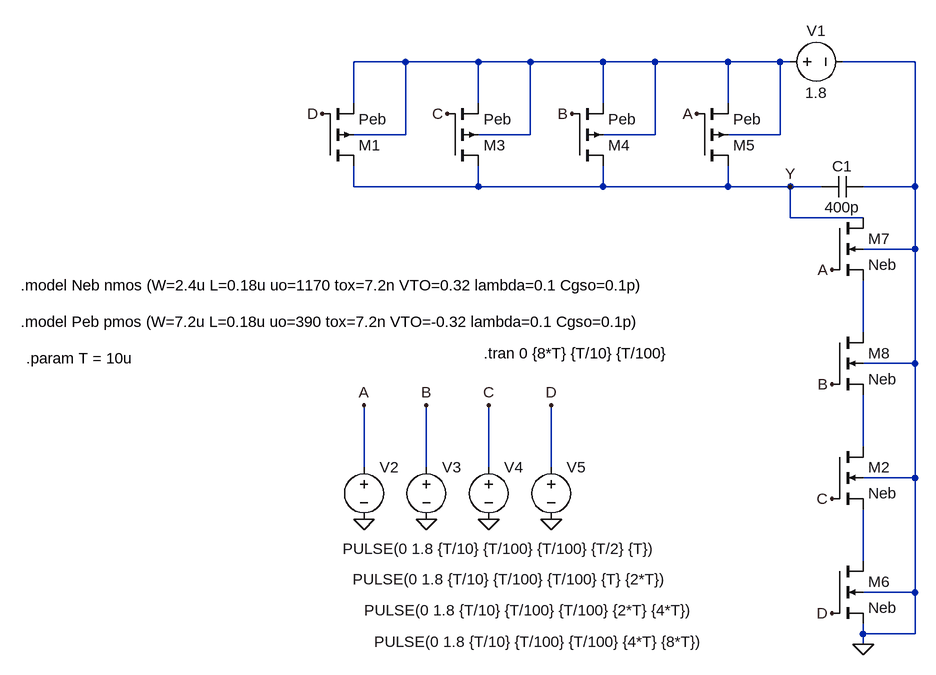
[diagram p0: schematic Draft6.asc]
Draft6.asc, the LTspice schematic file:
Version 4
SHEET 1 1276 780
WIRE 384 -176 304 -176
WIRE 496 -176 384 -176
WIRE 576 -176 496 -176
WIRE 688 -176 576 -176
WIRE 768 -176 688 -176
WIRE 880 -176 768 -176
WIRE 960 -176 880 -176
WIRE 976 -176 960 -176
WIRE 1168 -176 1056 -176
WIRE 304 -112 304 -176
WIRE 496 -112 496 -176
WIRE 688 -112 688 -176
WIRE 880 -112 880 -176
WIRE 384 -64 384 -176
WIRE 384 -64 304 -64
WIRE 576 -64 576 -176
WIRE 576 -64 496 -64
WIRE 768 -64 768 -176
WIRE 768 -64 688 -64
WIRE 960 -64 960 -176
WIRE 960 -64 880 -64
WIRE 304 16 304 -16
WIRE 496 16 496 -16
WIRE 496 16 304 16
WIRE 688 16 688 -16
WIRE 688 16 496 16
WIRE 880 16 880 -16
WIRE 880 16 688 16
WIRE 976 16 880 16
WIRE 1024 16 976 16
WIRE 1168 16 1168 -176
WIRE 1168 16 1088 16
WIRE 976 64 976 16
WIRE 1088 64 976 64
WIRE 1168 112 1168 16
WIRE 1168 112 1088 112
WIRE 1088 240 1088 160
WIRE 1168 288 1168 112
WIRE 1168 288 1088 288
WIRE 1088 416 1088 336
WIRE 320 448 320 352
WIRE 416 448 416 352
WIRE 512 448 512 352
WIRE 608 448 608 352
WIRE 1168 464 1168 288
WIRE 1168 464 1088 464
WIRE 1088 592 1088 512
WIRE 1168 640 1168 464
WIRE 1168 640 1088 640
WIRE 1088 704 1088 688
WIRE 1168 704 1168 640
WIRE 1168 704 1088 704
WIRE 1088 720 1088 704
FLAG 1088 720 0
FLAG 256 -96 D
FLAG 448 -96 C
FLAG 640 -96 B
FLAG 832 -96 A
FLAG 1040 144 A
FLAG 1040 320 B
FLAG 1040 496 C
FLAG 1040 672 D
FLAG 976 16 Y
FLAG 320 528 0
FLAG 416 528 0
FLAG 512 528 0
FLAG 608 528 0
FLAG 320 352 A
FLAG 416 352 B
FLAG 512 352 C
FLAG 608 352 D
SYMBOL pmos4 256 -16 M180
SYMATTR InstName M1
SYMATTR Value Peb
SYMBOL nmos4 1040 416 R0
SYMATTR InstName M2
SYMATTR Value Neb
SYMBOL voltage 960 -176 R270
WINDOW 0 32 56 VTop 2
WINDOW 3 -32 56 VBottom 2
WINDOW 123 0 0 Left 2
WINDOW 39 0 0 Left 2
SYMATTR InstName V1
SYMATTR Value 1.8
SYMBOL pmos4 448 -16 M180
SYMATTR InstName M3
SYMATTR Value Peb
SYMBOL pmos4 640 -16 M180
SYMATTR InstName M4
SYMATTR Value Peb
SYMBOL pmos4 832 -16 M180
SYMATTR InstName M5
SYMATTR Value Peb
SYMBOL nmos4 1040 592 R0
SYMATTR InstName M6
SYMATTR Value Neb
SYMBOL nmos4 1040 64 R0
SYMATTR InstName M7
SYMATTR Value Neb
SYMBOL nmos4 1040 240 R0
SYMATTR InstName M8
SYMATTR Value Neb
SYMBOL voltage 320 432 R0
WINDOW 3 -33 141 Left 2
WINDOW 123 0 0 Left 2
WINDOW 39 0 0 Left 2
SYMATTR InstName V2
SYMATTR Value PULSE(0 1.8 {T/10} {T/100} {T/100} {T/2} {T})
SYMBOL voltage 416 432 R0
WINDOW 3 -113 188 Left 2
WINDOW 123 0 0 Left 2
WINDOW 39 0 0 Left 2
SYMATTR InstName V3
SYMATTR Value PULSE(0 1.8 {T/10} {T/100} {T/100} {T} {2*T})
SYMBOL voltage 512 432 R0
WINDOW 3 -192 236 Left 2
WINDOW 123 0 0 Left 2
WINDOW 39 0 0 Left 2
SYMATTR InstName V4
SYMATTR Value PULSE(0 1.8 {T/10} {T/100} {T/100} {2*T} {4*T})
SYMBOL voltage 608 432 R0
WINDOW 3 -272 284 Left 2
SYMATTR InstName V5
SYMATTR Value PULSE(0 1.8 {T/10} {T/100} {T/100} {4*T} {8*T})
SYMBOL cap 1088 0 R90
WINDOW 0 0 32 VBottom 2
WINDOW 3 32 32 VTop 2
SYMATTR InstName C1
SYMATTR Value 400p
TEXT -208 168 Left 2 !.model Neb nmos (W=2.4u L=0.18u uo=1170 tox=7.2n VTO=0.32 lambda=0.1 Cgso=0.1p)
TEXT -208 224 Left 2 !.model Peb pmos (W=7.2u L=0.18u uo=390 tox=7.2n VTO=-0.32 lambda=0.1 Cgso=0.1p)
TEXT -200 280 Left 2 !.param T = 10u
TEXT 504 272 Left 2 !.tran 0 {8*T} {T/10} {T/100}

The netlist it stands for:
* Draft6.asc
M1 Y D N001 N001 Peb
M2 N003 C N004 0 Neb
V1 N001 0 1.8
M3 Y C N001 N001 Peb
M4 Y B N001 N001 Peb
M5 Y A N001 N001 Peb
M6 N004 D 0 0 Neb
M7 Y A N002 0 Neb
M8 N002 B N003 0 Neb
V2 A 0 PULSE(0 1.8 {T/10} {T/100} {T/100} {T/2} {T})
V3 B 0 PULSE(0 1.8 {T/10} {T/100} {T/100} {T} {2*T})
V4 C 0 PULSE(0 1.8 {T/10} {T/100} {T/100} {2*T} {4*T})
V5 D 0 PULSE(0 1.8 {T/10} {T/100} {T/100} {4*T} {8*T})
C1 0 Y 400p
.model NMOS NMOS
.model PMOS PMOS
.lib standard.mos
.model Neb nmos (W=2.4u L=0.18u uo=1170 tox=7.2n VTO=0.32 lambda=0.1 Cgso=0.1p)
.model Peb pmos (W=7.2u L=0.18u uo=390 tox=7.2n VTO=-0.32 lambda=0.1 Cgso=0.1p)
.param T = 10u
.tran 0 {8*T} {T/10} {T/100}
.backanno
.end

* Results of the author's LTspice run, read from the files saved beside the schematic
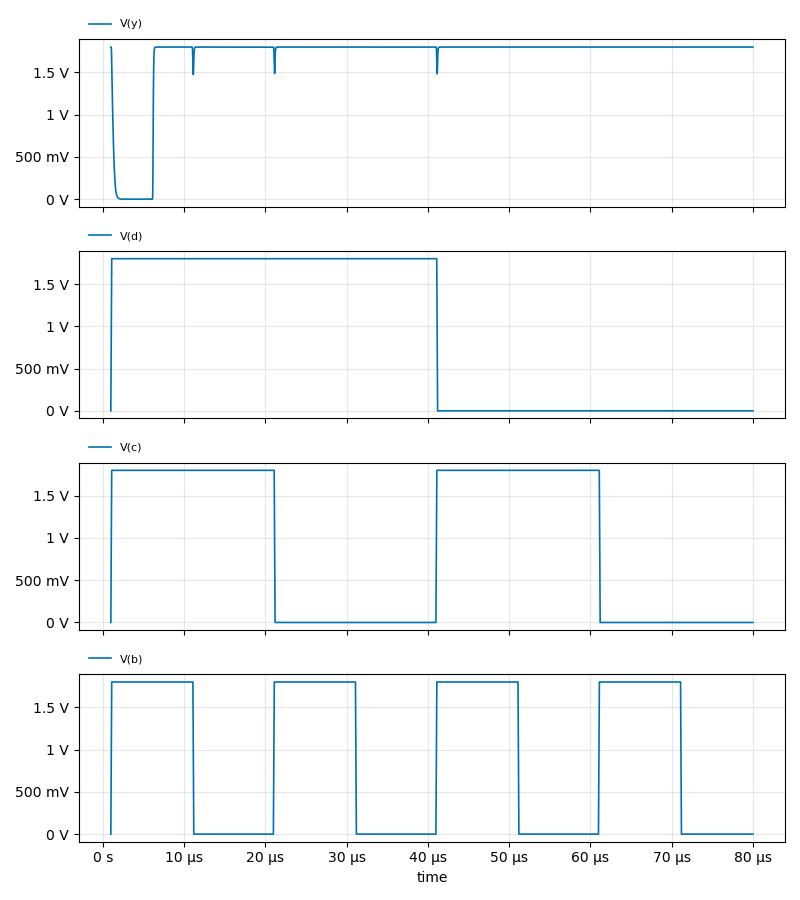
[diagram p1: Transient Analysis of Draft6.asc, plotted from the saved traces]
* Transient Analysis, 1 run:
*   V(y): min -874.9 nV, max 1.8 V, average 1.686 V, rms 1.74 V, last 1.8 V
*   V(d): min 0 V, max 1.8 V, average 913.7 mV, rms 1.282 V, last 0 V
*   V(c): min 0 V, max 1.8 V, average 915.9 mV, rms 1.283 V, last 0 V
*   V(b): min 0 V, max 1.8 V, average 920.5 mV, rms 1.285 V, last 0 V